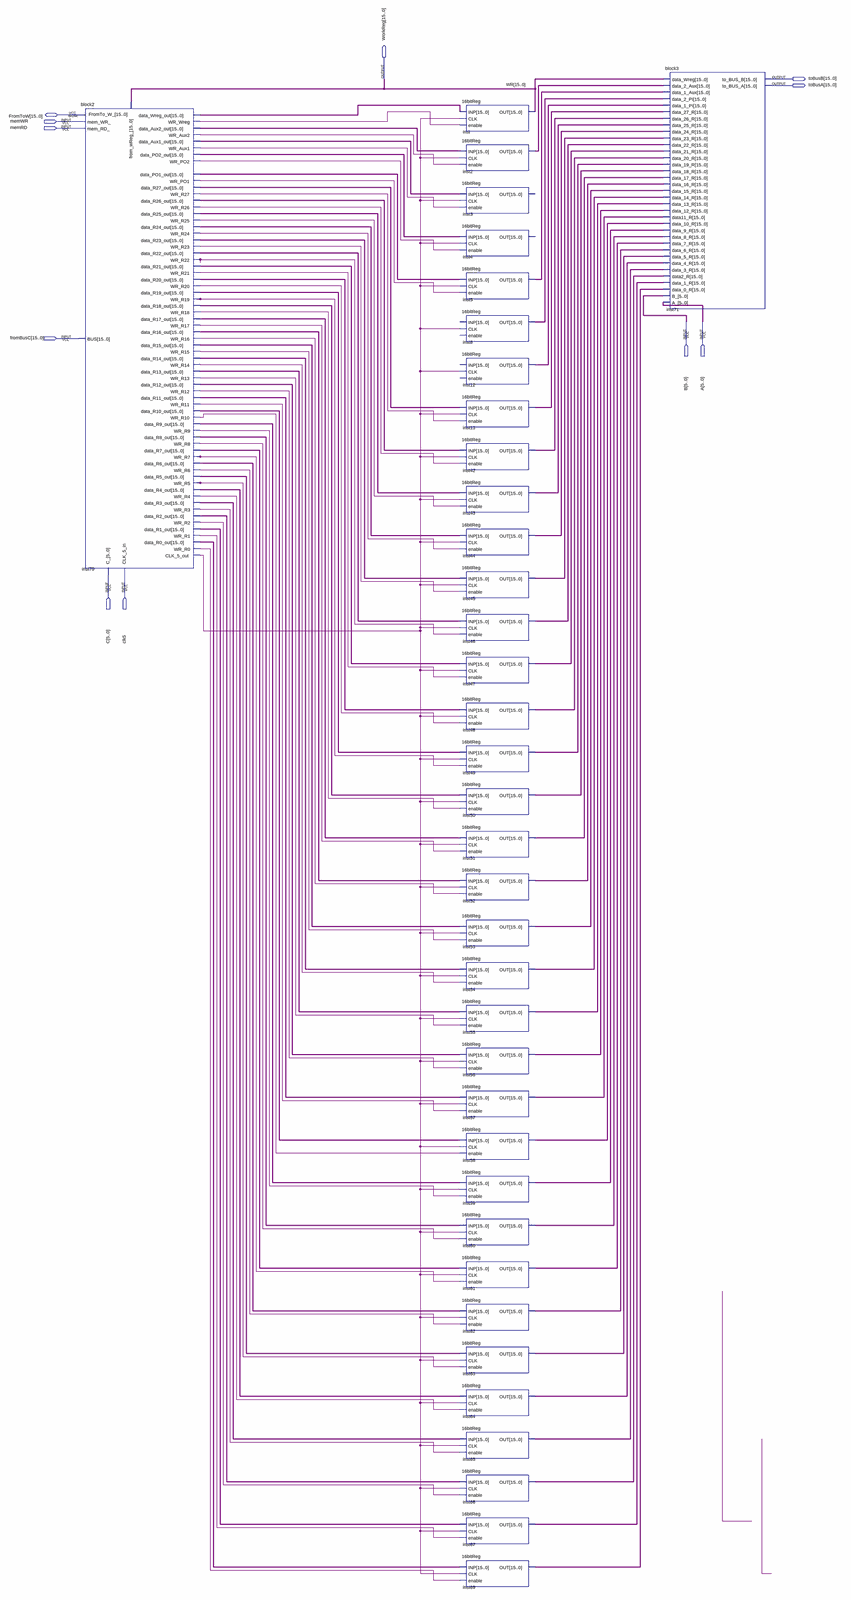
[diagram p0: schematic sheet, whole]
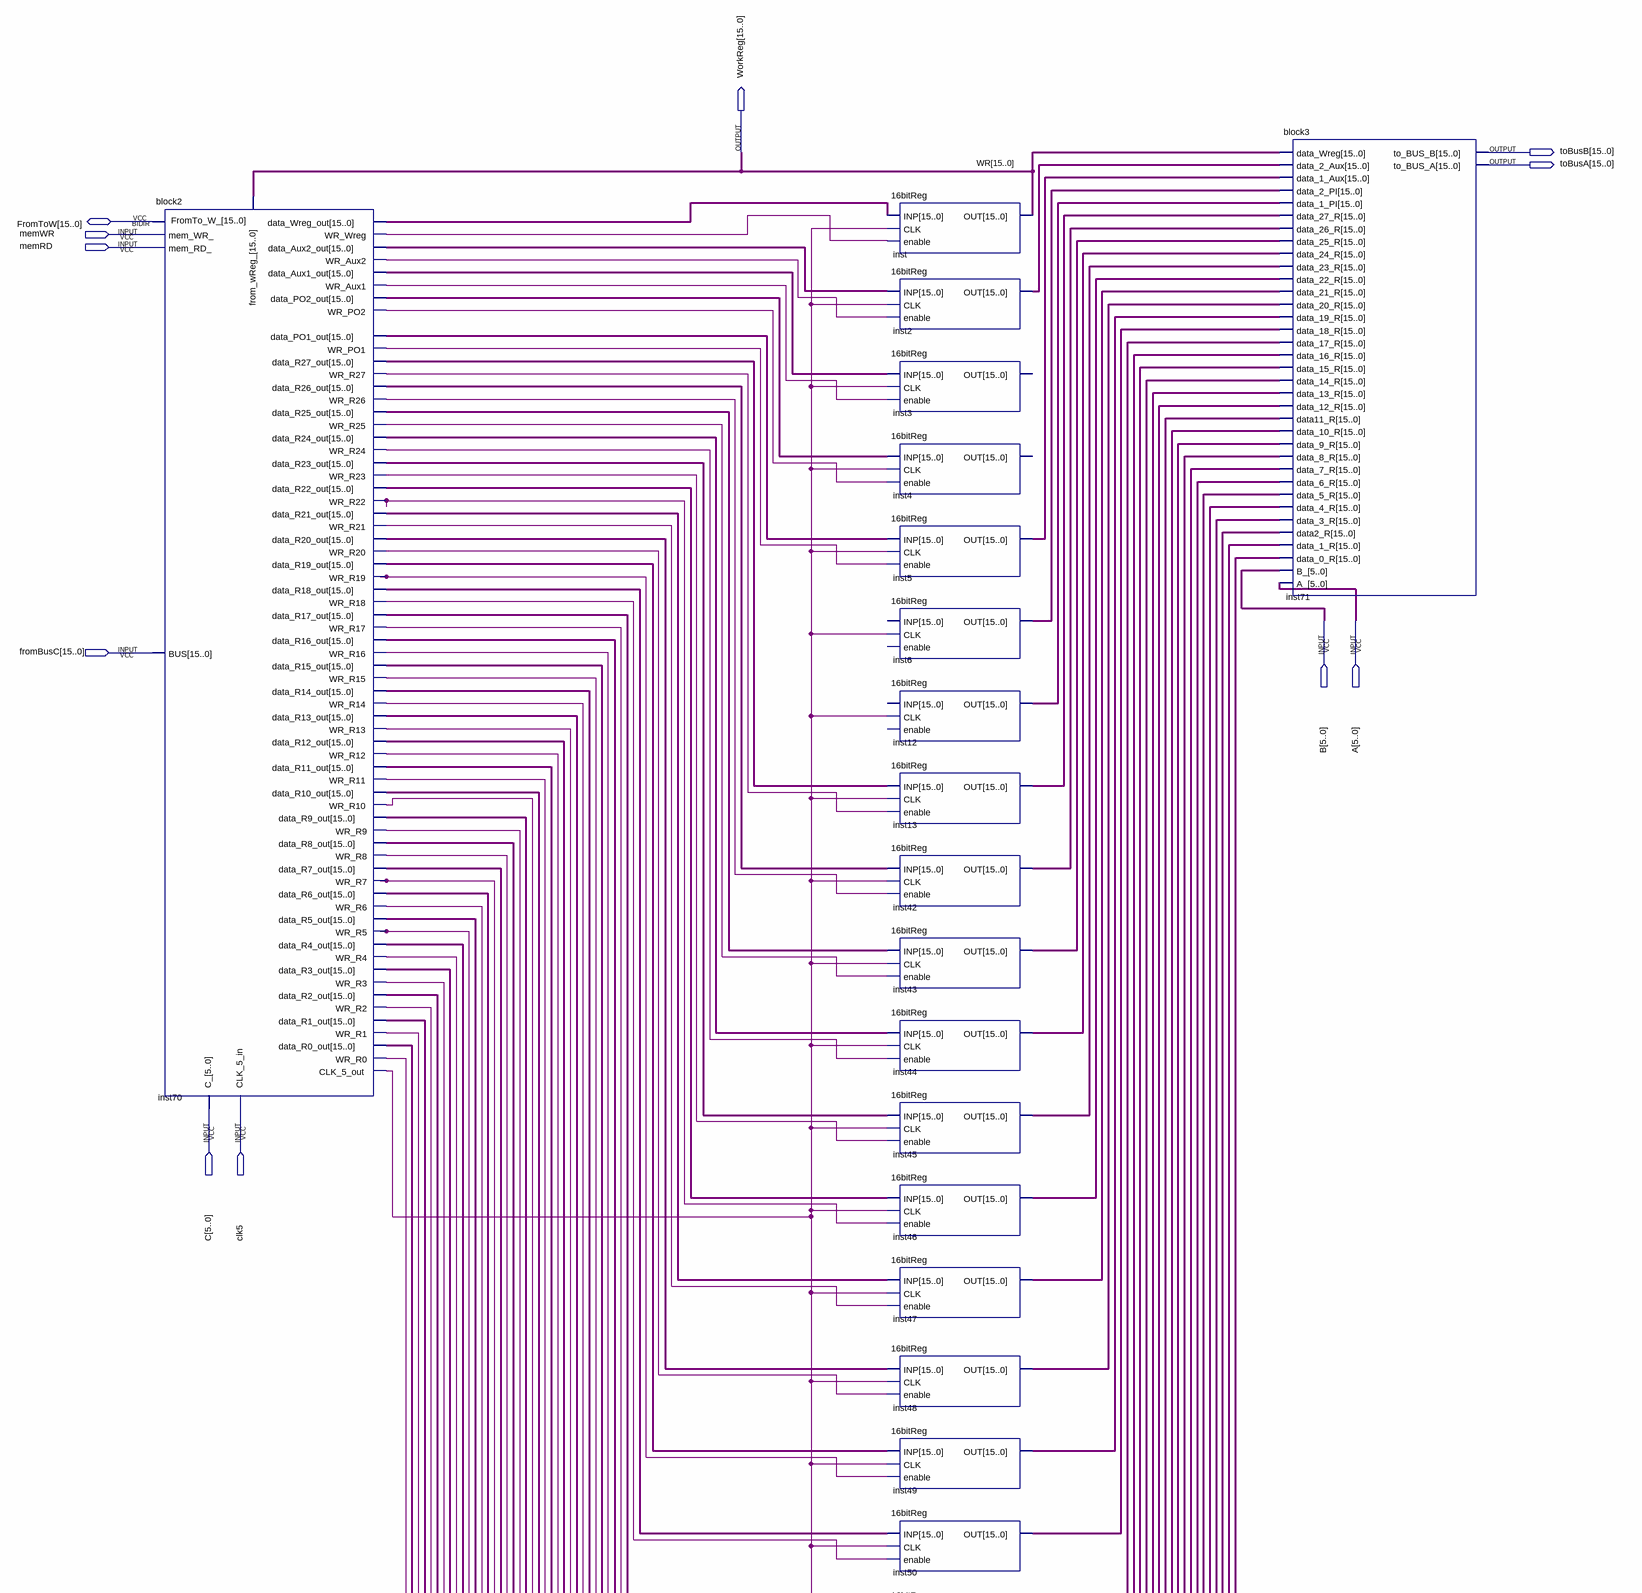
[diagram p1: schematic sheet, upper part]
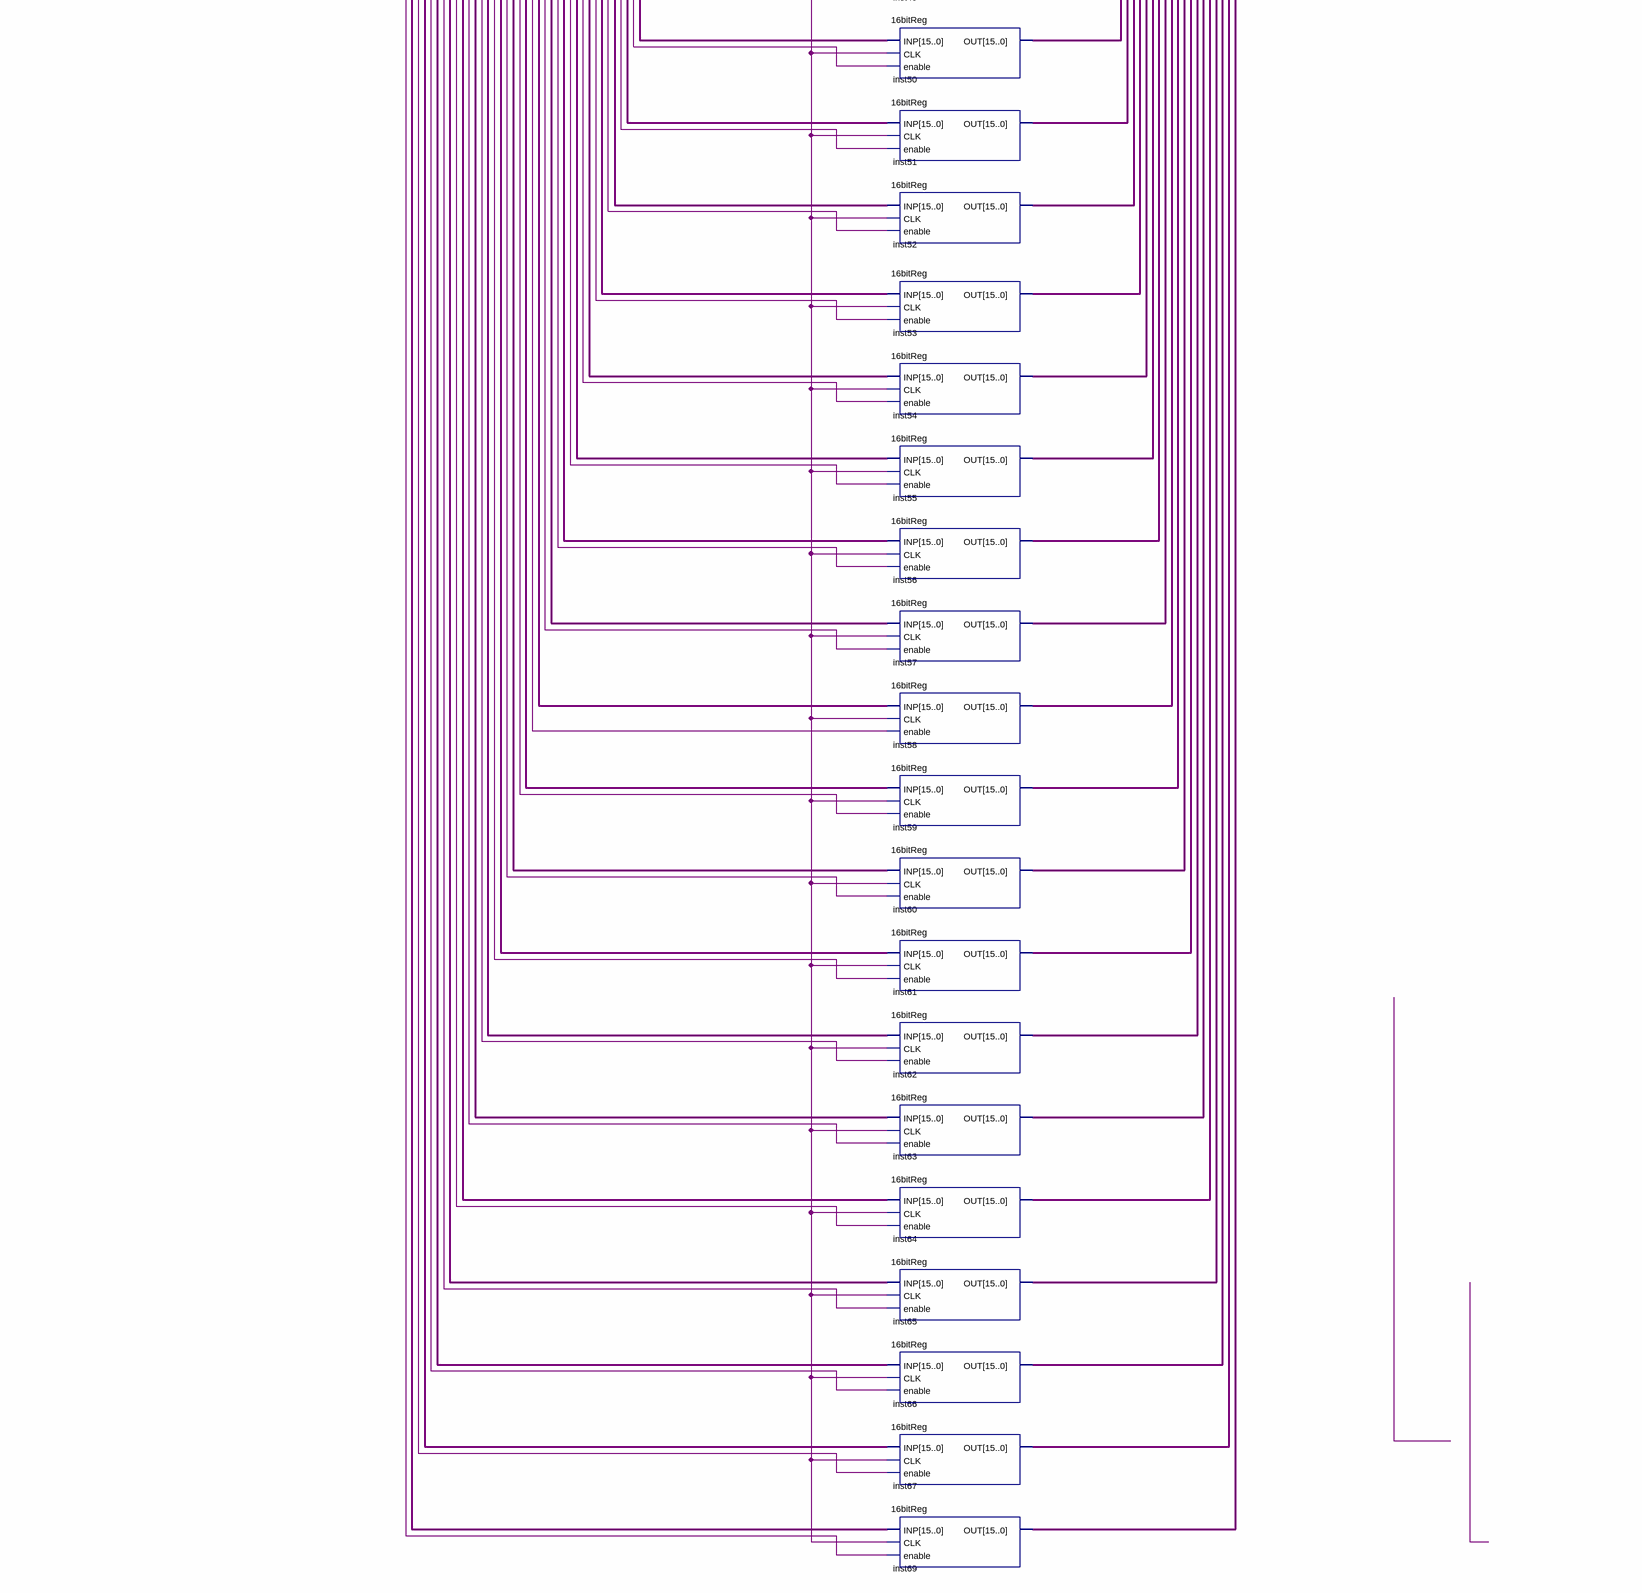
[diagram p2: schematic sheet, lower part]
// Quartus schematic RegisterBank.bdf as structural Verilog: 37 symbols, 11 pins
module RegisterBank (
  input  memWR,
  input  memRD,
  input  [5:0] B,
  input  [5:0] A,
  input  [15:0] fromBusC,
  input  [5:0] C,
  input  clk5,
  inout  [15:0] FromToW,
  output [15:0] WorkReg,
  output [15:0] toBusB,
  output [15:0] toBusA
);

  wire inst70_clk_5_out, inst70_wr_aux1, inst70_wr_aux2, inst70_wr_po1, inst70_wr_po2, inst70_wr_r0,
       inst70_wr_r1, inst70_wr_r2, inst70_wr_r3, inst70_wr_r4, inst70_wr_r5, inst70_wr_r6, inst70_wr_r7,
       inst70_wr_r8, inst70_wr_r9, inst70_wr_r10, inst70_wr_r11, inst70_wr_r12, inst70_wr_r13, inst70_wr_r14,
       inst70_wr_r15, inst70_wr_r16, inst70_wr_r17, inst70_wr_r18, inst70_wr_r19, inst70_wr_r20,
       inst70_wr_r21, inst70_wr_r22, inst70_wr_r23, inst70_wr_r24, inst70_wr_r25, inst70_wr_r26,
       inst70_wr_r27, inst70_wr_wreg;
  wire [15:0] inst2_out, inst5_out, inst6_out, inst12_out, inst13_out, inst42_out, inst43_out, inst44_out,
       inst45_out, inst46_out, inst47_out, inst48_out, inst49_out, inst50_out, inst51_out, inst52_out,
       inst53_out, inst54_out, inst55_out, inst56_out, inst57_out, inst58_out, inst59_out, inst60_out,
       inst61_out, inst62_out, inst63_out, inst64_out, inst65_out, inst66_out, inst67_out, inst69_out,
       inst70_data_aux1_out, inst70_data_aux2_out, inst70_data_po1_out, inst70_data_po2_out,
       inst70_data_r0_out, inst70_data_r1_out, inst70_data_r2_out, inst70_data_r3_out, inst70_data_r4_out,
       inst70_data_r5_out, inst70_data_r6_out, inst70_data_r7_out, inst70_data_r8_out, inst70_data_r9_out,
       inst70_data_r10_out, inst70_data_r11_out, inst70_data_r12_out, inst70_data_r13_out,
       inst70_data_r14_out, inst70_data_r15_out, inst70_data_r16_out, inst70_data_r17_out,
       inst70_data_r18_out, inst70_data_r19_out, inst70_data_r20_out, inst70_data_r21_out,
       inst70_data_r22_out, inst70_data_r23_out, inst70_data_r24_out, inst70_data_r25_out,
       inst70_data_r26_out, inst70_data_r27_out, inst70_data_wreg_out;

  block2 inst70 (
    .from_wReg_(WorkReg), .mem_WR_(memWR), .mem_RD_(memRD), .BUS(fromBusC), .C_(C), .CLK_5_in(clk5),
    .data_Wreg_out(inst70_data_wreg_out), .WR_Wreg(inst70_wr_wreg), .data_Aux2_out(inst70_data_aux2_out),
    .WR_Aux2(inst70_wr_aux2), .data_Aux1_out(inst70_data_aux1_out), .WR_Aux1(inst70_wr_aux1),
    .data_PO2_out(inst70_data_po2_out), .WR_PO2(inst70_wr_po2), .data_PO1_out(inst70_data_po1_out),
    .WR_PO1(inst70_wr_po1), .data_R27_out(inst70_data_r27_out), .WR_R27(inst70_wr_r27),
    .data_R26_out(inst70_data_r26_out), .WR_R26(inst70_wr_r26), .data_R25_out(inst70_data_r25_out),
    .WR_R25(inst70_wr_r25), .data_R24_out(inst70_data_r24_out), .WR_R24(inst70_wr_r24),
    .data_R23_out(inst70_data_r23_out), .WR_R23(inst70_wr_r23), .data_R22_out(inst70_data_r22_out),
    .WR_R22(inst70_wr_r22), .data_R21_out(inst70_data_r21_out), .WR_R21(inst70_wr_r21),
    .data_R20_out(inst70_data_r20_out), .WR_R20(inst70_wr_r20), .data_R19_out(inst70_data_r19_out),
    .WR_R19(inst70_wr_r19), .data_R18_out(inst70_data_r18_out), .WR_R18(inst70_wr_r18),
    .data_R17_out(inst70_data_r17_out), .WR_R17(inst70_wr_r17), .data_R16_out(inst70_data_r16_out),
    .WR_R16(inst70_wr_r16), .data_R15_out(inst70_data_r15_out), .WR_R15(inst70_wr_r15),
    .data_R14_out(inst70_data_r14_out), .WR_R14(inst70_wr_r14), .data_R13_out(inst70_data_r13_out),
    .WR_R13(inst70_wr_r13), .data_R12_out(inst70_data_r12_out), .WR_R12(inst70_wr_r12),
    .data_R11_out(inst70_data_r11_out), .WR_R11(inst70_wr_r11), .data_R10_out(inst70_data_r10_out),
    .WR_R10(inst70_wr_r10), .data_R9_out(inst70_data_r9_out), .WR_R9(inst70_wr_r9),
    .data_R8_out(inst70_data_r8_out), .WR_R8(inst70_wr_r8), .data_R7_out(inst70_data_r7_out),
    .WR_R7(inst70_wr_r7), .data_R6_out(inst70_data_r6_out), .WR_R6(inst70_wr_r6),
    .data_R5_out(inst70_data_r5_out), .WR_R5(inst70_wr_r5), .data_R4_out(inst70_data_r4_out),
    .WR_R4(inst70_wr_r4), .data_R3_out(inst70_data_r3_out), .WR_R3(inst70_wr_r3),
    .data_R2_out(inst70_data_r2_out), .WR_R2(inst70_wr_r2), .data_R1_out(inst70_data_r1_out),
    .WR_R1(inst70_wr_r1), .data_R0_out(inst70_data_r0_out), .WR_R0(inst70_wr_r0),
    .CLK_5_out(inst70_clk_5_out), .FromTo_W_(FromToW));
  \16bitReg  inst (.INP(inst70_data_wreg_out), .enable(inst70_wr_wreg), .CLK(inst70_clk_5_out), .OUT(WorkReg));
  \16bitReg  inst2 (.INP(inst70_data_aux2_out), .enable(inst70_wr_aux2), .CLK(inst70_clk_5_out), .OUT(inst2_out));
  \16bitReg  inst3 (.INP(inst70_data_aux1_out), .enable(inst70_wr_aux1), .CLK(inst70_clk_5_out));  // open: OUT
  \16bitReg  inst4 (.INP(inst70_data_po2_out), .enable(inst70_wr_po2), .CLK(inst70_clk_5_out));  // open: OUT
  \16bitReg  inst5 (.INP(inst70_data_po1_out), .enable(inst70_wr_po1), .CLK(inst70_clk_5_out), .OUT(inst5_out));
  \16bitReg  inst6 (.CLK(inst70_clk_5_out), .OUT(inst6_out));  // open: INP, enable
  \16bitReg  inst12 (.CLK(inst70_clk_5_out), .OUT(inst12_out));  // open: INP, enable
  \16bitReg  inst13 (.INP(inst70_data_r27_out), .enable(inst70_wr_r27), .CLK(inst70_clk_5_out), .OUT(inst13_out));
  \16bitReg  inst42 (.INP(inst70_data_r26_out), .enable(inst70_wr_r26), .CLK(inst70_clk_5_out), .OUT(inst42_out));
  \16bitReg  inst43 (.INP(inst70_data_r25_out), .enable(inst70_wr_r25), .CLK(inst70_clk_5_out), .OUT(inst43_out));
  \16bitReg  inst44 (.INP(inst70_data_r24_out), .enable(inst70_wr_r24), .CLK(inst70_clk_5_out), .OUT(inst44_out));
  \16bitReg  inst45 (.INP(inst70_data_r23_out), .enable(inst70_wr_r23), .CLK(inst70_clk_5_out), .OUT(inst45_out));
  \16bitReg  inst46 (.INP(inst70_data_r22_out), .enable(inst70_wr_r22), .CLK(inst70_clk_5_out), .OUT(inst46_out));
  \16bitReg  inst47 (.INP(inst70_data_r21_out), .enable(inst70_wr_r21), .CLK(inst70_clk_5_out), .OUT(inst47_out));
  \16bitReg  inst48 (.INP(inst70_data_r20_out), .enable(inst70_wr_r20), .CLK(inst70_clk_5_out), .OUT(inst48_out));
  \16bitReg  inst49 (.INP(inst70_data_r19_out), .enable(inst70_wr_r19), .CLK(inst70_clk_5_out), .OUT(inst49_out));
  \16bitReg  inst50 (.INP(inst70_data_r18_out), .enable(inst70_wr_r18), .CLK(inst70_clk_5_out), .OUT(inst50_out));
  \16bitReg  inst51 (.INP(inst70_data_r17_out), .enable(inst70_wr_r17), .CLK(inst70_clk_5_out), .OUT(inst51_out));
  \16bitReg  inst52 (.INP(inst70_data_r16_out), .enable(inst70_wr_r16), .CLK(inst70_clk_5_out), .OUT(inst52_out));
  \16bitReg  inst53 (.INP(inst70_data_r15_out), .enable(inst70_wr_r15), .CLK(inst70_clk_5_out), .OUT(inst53_out));
  \16bitReg  inst54 (.INP(inst70_data_r14_out), .enable(inst70_wr_r14), .CLK(inst70_clk_5_out), .OUT(inst54_out));
  \16bitReg  inst55 (.INP(inst70_data_r13_out), .enable(inst70_wr_r13), .CLK(inst70_clk_5_out), .OUT(inst55_out));
  \16bitReg  inst56 (.INP(inst70_data_r12_out), .enable(inst70_wr_r12), .CLK(inst70_clk_5_out), .OUT(inst56_out));
  \16bitReg  inst57 (.INP(inst70_data_r11_out), .enable(inst70_wr_r11), .CLK(inst70_clk_5_out), .OUT(inst57_out));
  \16bitReg  inst58 (.INP(inst70_data_r10_out), .enable(inst70_wr_r10), .CLK(inst70_clk_5_out), .OUT(inst58_out));
  \16bitReg  inst59 (.INP(inst70_data_r9_out), .enable(inst70_wr_r9), .CLK(inst70_clk_5_out), .OUT(inst59_out));
  \16bitReg  inst60 (.INP(inst70_data_r8_out), .enable(inst70_wr_r8), .CLK(inst70_clk_5_out), .OUT(inst60_out));
  \16bitReg  inst61 (.INP(inst70_data_r7_out), .enable(inst70_wr_r7), .CLK(inst70_clk_5_out), .OUT(inst61_out));
  \16bitReg  inst62 (.INP(inst70_data_r6_out), .enable(inst70_wr_r6), .CLK(inst70_clk_5_out), .OUT(inst62_out));
  \16bitReg  inst63 (.INP(inst70_data_r5_out), .enable(inst70_wr_r5), .CLK(inst70_clk_5_out), .OUT(inst63_out));
  \16bitReg  inst64 (.INP(inst70_data_r4_out), .enable(inst70_wr_r4), .CLK(inst70_clk_5_out), .OUT(inst64_out));
  \16bitReg  inst65 (.INP(inst70_data_r3_out), .enable(inst70_wr_r3), .CLK(inst70_clk_5_out), .OUT(inst65_out));
  \16bitReg  inst66 (.INP(inst70_data_r2_out), .enable(inst70_wr_r2), .CLK(inst70_clk_5_out), .OUT(inst66_out));
  \16bitReg  inst67 (.INP(inst70_data_r1_out), .enable(inst70_wr_r1), .CLK(inst70_clk_5_out), .OUT(inst67_out));
  \16bitReg  inst69 (.INP(inst70_data_r0_out), .enable(inst70_wr_r0), .CLK(inst70_clk_5_out), .OUT(inst69_out));
  block3 inst71 (
    .data_Wreg(WorkReg), .data_2_Aux(inst2_out), .data_1_Aux(inst5_out), .data_2_PI(inst6_out),
    .data_1_PI(inst12_out), .data_27_R(inst13_out), .data_26_R(inst42_out), .data_25_R(inst43_out),
    .data_24_R(inst44_out), .data_23_R(inst45_out), .data_22_R(inst46_out), .data_21_R(inst47_out),
    .data_20_R(inst48_out), .data_19_R(inst49_out), .data_18_R(inst50_out), .data_17_R(inst51_out),
    .data_16_R(inst52_out), .data_15_R(inst53_out), .data_14_R(inst54_out), .data_13_R(inst55_out),
    .data_12_R(inst56_out), .data11_R(inst57_out), .data_10_R(inst58_out), .data_9_R(inst59_out),
    .data_8_R(inst60_out), .data_7_R(inst61_out), .data_6_R(inst62_out), .data_5_R(inst63_out),
    .data_4_R(inst64_out), .data_3_R(inst65_out), .data2_R(inst66_out), .data_1_R(inst67_out),
    .data_0_R(inst69_out), .B_(B), .A_(A), .to_BUS_B(toBusB), .to_BUS_A(toBusA));

  // Other names for the same wires on the sheet: WR[15:0] = WorkReg
endmodule
